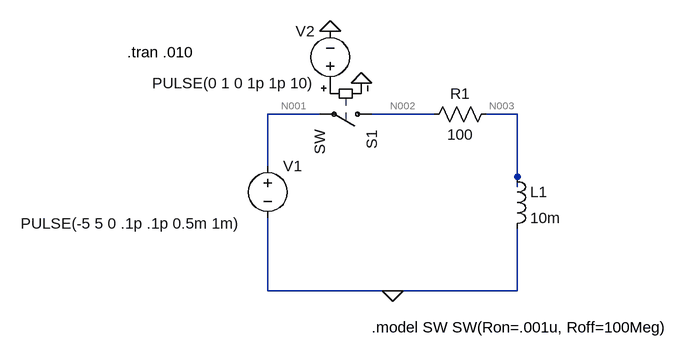
[diagram p0: schematic Circuit5.asc]
Circuit5.asc, the LTspice schematic file:
Version 4.1
SHEET 1 880 680
WIRE 112 64 32 64
WIRE 288 64 192 64
WIRE 416 64 368 64
WIRE 32 144 32 64
WIRE 416 160 416 64
WIRE 416 176 416 160
WIRE 32 336 32 224
WIRE 224 336 32 336
WIRE 416 336 416 240
WIRE 416 336 224 336
FLAG 128 -64 0
FLAG 176 16 0
FLAG 224 336 0
SYMBOL voltage 32 128 R0
WINDOW 3 -380 104 Left 2
WINDOW 123 0 0 Left 0
WINDOW 39 0 0 Left 0
SYMATTR Value PULSE(-5 5 0 .1p .1p 0.5m 1m)
SYMATTR InstName V1
SYMBOL sw 208 64 R90
SYMATTR InstName S1
SYMBOL res 384 48 R90
WINDOW 0 0 56 VBottom 2
WINDOW 3 32 56 VTop 2
SYMATTR InstName R1
SYMATTR Value 100
SYMBOL voltage 128 32 R180
WINDOW 0 24 96 Left 2
WINDOW 3 24 16 Left 2
WINDOW 123 0 0 Left 0
WINDOW 39 0 0 Left 0
SYMATTR InstName V2
SYMATTR Value PULSE(0 1 0 1p 1p 10)
SYMBOL ind 400 144 R0
SYMATTR InstName L1
SYMATTR Value 10m
TEXT -184 -32 Left 2 !.tran .010
TEXT 192 392 Left 2 !.model SW SW(Ron=.001u, Roff=100Meg)

The netlist it stands for:
* Circuit5.asc
V1 N001 0 PULSE(-5 5 0 .1p .1p 0.5m 1m)
S1 N002 N001 P001 0 SW
R1 N003 N002 100
V2 P001 0 PULSE(0 1 0 1p 1p 10)
L1 N003 0 10m
.tran .010
.model SW SW(Ron=.001u, Roff=100Meg)
.backanno
.end

* Results of the author's LTspice run, read from the files saved beside the schematic
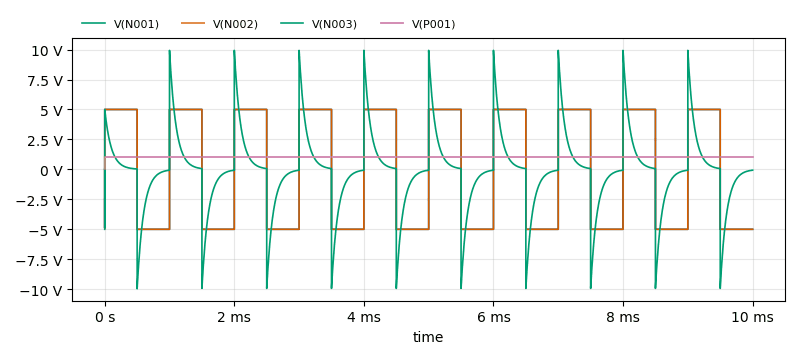
[diagram p1: Transient Analysis of Circuit5.asc, plotted from the saved traces]
* Transient Analysis, 1 run:
*   V(N001): min -5 V, max 5 V, average 0 V, rms 5 V, last -5 V
*   V(N002): min -5 V, max 5 V, average 0 V, rms 5 V, last -5 V
*   V(N003): min -9.966 V, max 9.933 V, average -49.4 mV, rms 3.093 V, last -66.72 mV
*   V(P001): min 0 V, max 1 V, average 1 V, rms 1 V, last 1 V